# Altium schematic sheet attack_board.SchDoc: <Enter Sheet Title>
size Letter; Organization: NewAE Technology Inc.; Address1: 1083 Queen St., Suite 196; Address2: Halifax; Address3: NS; Address4: Canada B3H 0B2; SheetApproved: NO
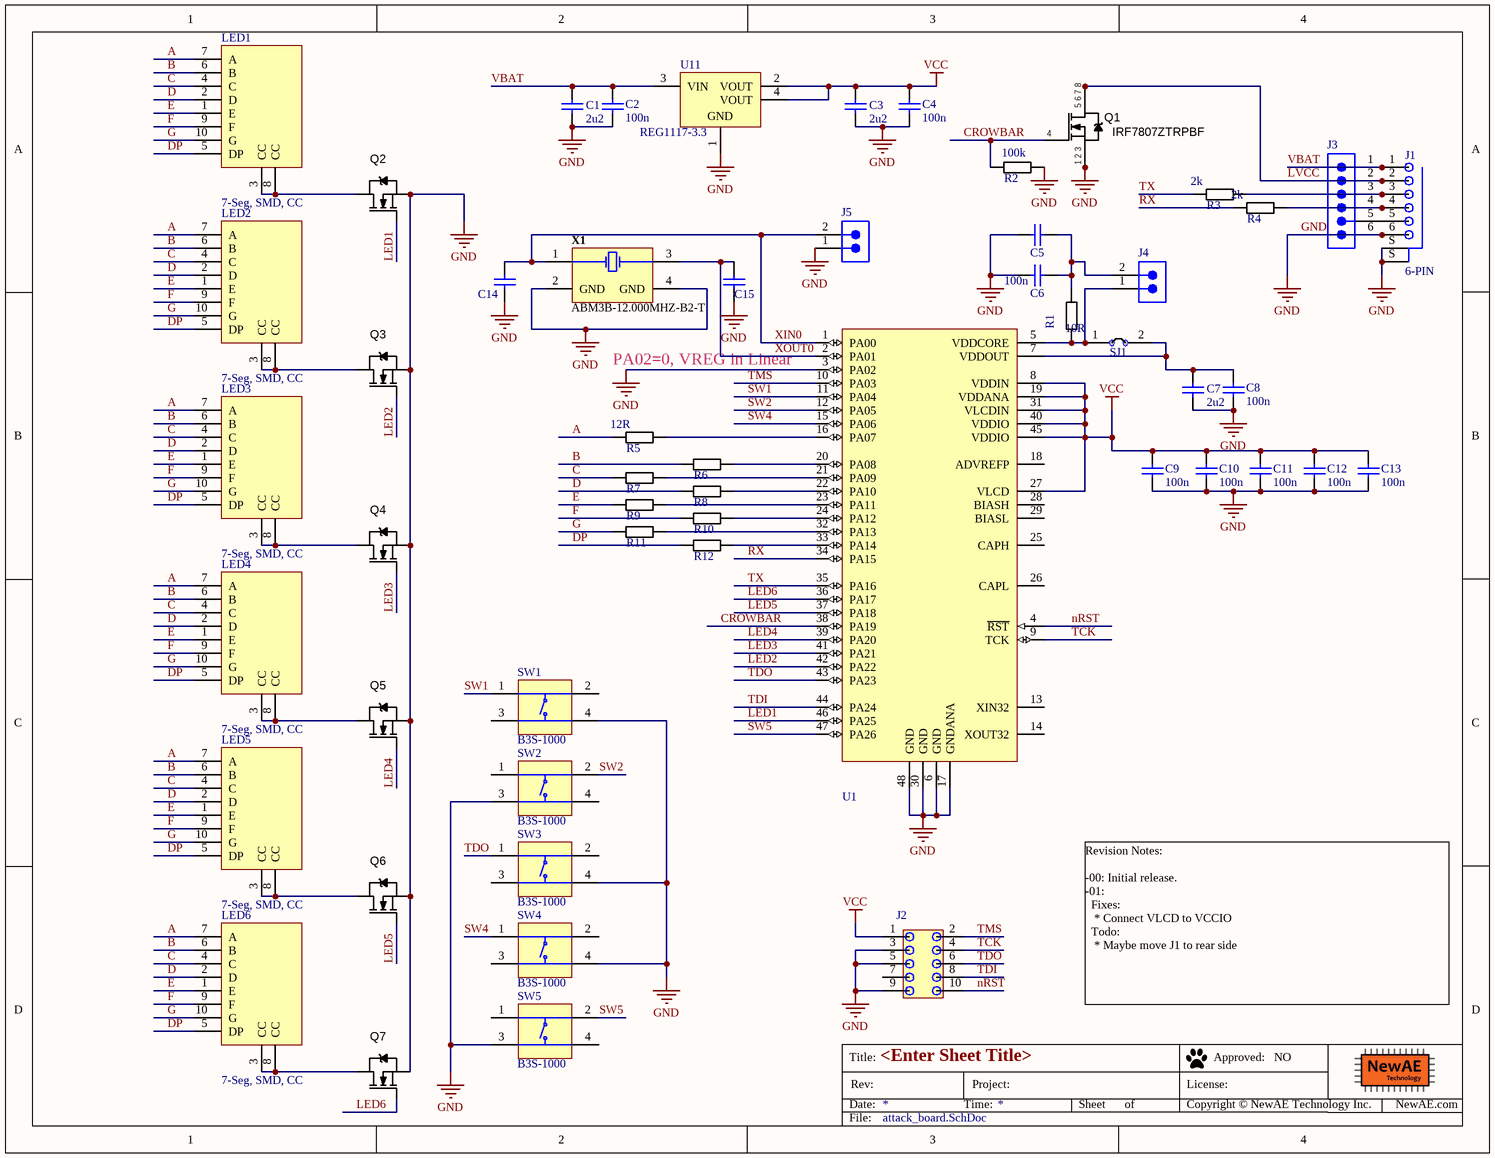
[diagram p0: attack_board.SchDoc]

## Parts
C1  2u2  [CAPC0603_M]
C2  100n  [CAPC0603_M]
C3  2u2  [CAPC0603_M]
C4  100n  [CAPC0603_M]
C5  2u2  [CAPC0603_M]  (value not drawn)
C6  100n  [CAPC0603_M]
C7  2u2  [CAPC0603_M]
C8  100n  [CAPC0603_M]
C9  100n  [CAPC0603_M]
C10  100n  [CAPC0603_M]
C11  100n  [CAPC0603_M]
C12  100n  [CAPC0603_M]
C13  100n  [CAPC0603_M]
C14  18p  [CAPC0402_M]  (value not drawn)
C15  18p  [CAPC0402_M]  (value not drawn)
J1  6-PIN  [10114828-10106LF]
J2  1296-T10  [1296-T10]  (value not drawn)
J3  (no value)  [SMTC-TSW-106-08-X-S-RA]
J4  (no value)  [SMTC-DW-02-16-X-S-200]
J5  (no value)  [SMTC-DW-02-16-X-S-200]
LED1  7-Seg, SMD, CC
LED2  7-Seg, SMD, CC
LED3  7-Seg, SMD, CC
LED4  7-Seg, SMD, CC
LED5  7-Seg, SMD, CC
LED6  7-Seg, SMD, CC
Q1  IRF7807ZTRPBF  [SOIC8_NARROW]
Q2  IRLML2502  [SOT95P245X110-3M]  (value not drawn)
Q3  IRLML2502  [SOT95P245X110-3M]  (value not drawn)
Q4  IRLML2502  [SOT95P245X110-3M]  (value not drawn)
Q5  IRLML2502  [SOT95P245X110-3M]  (value not drawn)
Q6  IRLML2502  [SOT95P245X110-3M]  (value not drawn)
Q7  IRLML2502  [SOT95P245X110-3M]  (value not drawn)
R1  10R  [RESC1608X55N]
R2  100k  [RESC1608X55N]
R3  2k  [RESC1608X55N]
R4  2k  [RESC1608X55N]
R5  12R  [RESC1608X55N]
R6  12R  [RESC1608X55N]  (value not drawn)
R7  12R  [RESC1608X55N]  (value not drawn)
R8  12R  [RESC1608X55N]  (value not drawn)
R9  12R  [RESC1608X55N]  (value not drawn)
R10  12R  [RESC1608X55N]  (value not drawn)
R11  12R  [RESC1608X55N]  (value not drawn)
R12  12R  [RESC1608X55N]  (value not drawn)
SJ1  NC  [SJ_2S_NC]  (value not drawn)  (no BOM)
SW1  B3S-1000  [OMRON-B3S-1000-4_V]
SW2  B3S-1000  [OMRON-B3S-1000-4_V]
SW3  B3S-1000  [OMRON-B3S-1000-4_V]
SW4  B3S-1000  [OMRON-B3S-1000-4_V]
SW5  B3S-1000  [OMRON-B3S-1000-4_V]
U1  ATSAM4LC2AA-AU  [TSQFP50P900X900X120-48N]  (value not drawn)
U11  REG1117-3.3  [TI-DCY4_M]
X1  ABM3B-12.000MHZ-B2-T  [ABRA-ABM3B-4_V]

## Nets
GND: C1.2 C2.1 C3.2 C4.1 C5.1 C6.1 C7.2 C8.1 C9.1 C10.1 C11.1 C12.1 C13.1 C14.1 C15.1 J1.6 J1.S(MNT) J2.3 J2.5 J2.9 J3.6 J5.1 Q1.1(1,2,3) Q1.2(S) Q1.3(S) Q2.2(S) Q3.2(S) Q4.2(S) Q5.2(S) Q6.2(S) Q7.2(S) R2.2 SW1.4 SW2.3 SW3.4 SW4.4 SW5.3 U1.3(PA02) U1.6(GND) U1.17(GNDANA) U1.30(GND) U1.48(GND) U11.1(GND) X1.2(GND) X1.4(GND)
VCC: C3.1 C4.2 C9.2 C10.2 C11.2 C12.2 C13.2 J2.1 U1.8(VDDIN) U1.19(VDDANA) U1.27(VLCD) U1.31(VLCDIN) U1.40(VDDIO) U1.45(VDDIO) U11.2(VOUT) U11.4(VOUT)
A: LED1.7(A) LED2.7(A) LED3.7(A) LED4.7(A) LED5.7(A) LED6.7(A) R5.1
B: LED1.6(B) LED2.6(B) LED3.6(B) LED4.6(B) LED5.6(B) LED6.6(B) R6.1
C: LED1.4(C) LED2.4(C) LED3.4(C) LED4.4(C) LED5.4(C) LED6.4(C) R7.1
CROWBAR: Q1.4(G) R2.1 U1.38(PA19)
D: LED1.2(D) LED2.2(D) LED3.2(D) LED4.2(D) LED5.2(D) LED6.2(D) R8.1
DP: LED1.5(DP) LED2.5(DP) LED3.5(DP) LED4.5(DP) LED5.5(DP) LED6.5(DP) R12.1
E: LED1.1(E) LED2.1(E) LED3.1(E) LED4.1(E) LED5.1(E) LED6.1(E) R9.1
F: LED1.9(F) LED2.9(F) LED3.9(F) LED4.9(F) LED5.9(F) LED6.9(F) R10.1
G: LED1.10(G) LED2.10(G) LED3.10(G) LED4.10(G) LED5.10(G) LED6.10(G) R11.1
LED1: Q2.1(G) U1.46(PA25)
LED2: Q3.1(G) U1.42(PA22)
LED3: Q4.1(G) U1.41(PA21)
LED4: Q5.1(G) U1.39(PA20)
LED5: Q6.1(G) U1.37(PA18)
LED6: Q7.1(G) U1.36(PA17)
LVCC: J1.2 J3.2 Q1.5(5,6,7,8) Q1.6(D) Q1.7(D) Q1.8(D)
nRST: J2.10 U1.4(~{RST})
RX: R4.1 U1.34(PA15)
SW1: SW1.1 U1.11(PA04)
SW2: SW2.2 U1.12(PA05)
SW4: SW4.1 U1.15(PA06)
SW5: SW5.2 U1.47(PA26)
TCK: J2.4 U1.9(TCK)
TDI: J2.8 U1.44(PA24)
TDO: J2.6 SW3.1 U1.43(PA23)
TMS: J2.2 U1.10(PA03)
TX: R3.1 U1.35(PA16)
VBAT: C1.1 C2.2 J1.1 J3.1 U11.3(VIN)
XIN0: C14.2 J5.2 U1.1(PA00) X1.1(X1)
XOUT0: C15.2 U1.2(PA01) X1.3(X2)
NetC5_2: C5.2 C6.2 J4.2 R1.1
NetC7_1: C7.1 C8.2 SJ1.2 U1.7(VDDOUT)
NetJ1_3: J1.3 J3.3 R3.2
NetJ1_4: J1.4 J3.4 R4.2
NetJ1_5: J1.5 J3.5
NetJ4_1: J4.1 R1.2 SJ1.1 U1.5(VDDCORE)
NetLED1_3: LED1.3(CC) LED1.8(CC) Q2.3(D)
NetLED2_3: LED2.3(CC) LED2.8(CC) Q3.3(D)
NetLED3_3: LED3.3(CC) LED3.8(CC) Q4.3(D)
NetLED4_3: LED4.3(CC) LED4.8(CC) Q5.3(D)
NetLED5_3: LED5.3(CC) LED5.8(CC) Q6.3(D)
NetLED6_3: LED6.3(CC) LED6.8(CC) Q7.3(D)
NetR5_2: R5.2 U1.16(PA07)
NetR6_2: R6.2 U1.20(PA08)
NetR7_2: R7.2 U1.21(PA09)
NetR8_2: R8.2 U1.22(PA10)
NetR9_2: R9.2 U1.23(PA11)
NetR10_2: R10.2 U1.24(PA12)
NetR11_2: R11.2 U1.32(PA13)
NetR12_2: R12.2 U1.33(PA14)

Not connected (* = marked no-connect by the designer): J2 7; SW1 2 3; SW2 1 4; SW3 2 3; SW4 2 3; SW5 1 4; U1 13(XIN32) 14(XOUT32) 18(ADVREFP) 25(CAPH) 26(CAPL) 28(BIASH) 29(BIASL)

## Notes on the sheet
- PA02=0, VREG in Linear
- Revision Notes:
  -00: Initial release.
  -01:
  Fixes:
  * Connect VLCD to VCCIO
  Todo:
  * Maybe move J1 to rear side
- Title:
- Date:
- Rev:
- Time:
- Project:
- Sheet
- of
- License:
- Copyright © NewAE Technology Inc.
- Approved:
- NewAE.com
- File:

## Library data of the parts
C1 C3 C5 C7 = CCHIP-2u2-0603: 2u2, 0603; Case-EIA: 0603; Case-Metric: 1608; Part Number: CCHIP-2u2-0603; Component Kind: Standard; Component Type: Standard; Footprint: 0603; Pin Count: 2; Value: 2u2; Mounting Technology: SMT
C2 C4 C6 C8-C13 = CCHIP-100n-0603: 100n, 0603; Case-EIA: 0603; Case-Metric: 1608; Part Number: CCHIP-100n-0603; Component Kind: Standard; Component Type: Standard; Footprint: 0603; Pin Count: 2; Value: 100n; Mounting Technology: SMT
C14 C15 = CCHIP-18p-0402: 18p, 0402; Case-EIA: 0402; Part Number: CCHIP-18p-0402; Component Kind: Standard; Component Type: Standard; Footprint: 0402; Pin Count: 2; Value: 18p; Mounting Technology: SMT
J1 = 10114828-10106LF: 1.25MM, 6POS, VERT SMD; Manufacture 1: FCI; Part Number: 10114828-10106LF; Component Kind: Standard; Component Type: Standard; Manufacture Part Number 1: 10114828-10106LF; Pin Count: 8; Supplier 1: Digi-Key; Supplier Part Number 1: 609-4390-1-ND; Mounting Technology: SMT; Pitch: 1.25mm; RoHS: Yes
J2 = 1296-T10: Header, 10-pin, SMD, 0.05"; Part Number: 1296-T10; Component Kind: Standard; Component Type: Standard; Mounting Technology: SMT
J3 = CMP-1024-00388-1: PartNumber: TSW-106-08-T-S-RA; Manufacturer: Samtec; Pitch: 2.54 mm; ComponentLink2Description: Datasheet; PackageReference: TSW-106-08-X-S-RA; ComponentLink2URL: http://www.samtec.com/documents/webfiles/pdf/TSW_TH.PDF; ComponentLink3Description: Package Specification; ComponentLink3URL: http://www.samtec.com/documents/webfiles/cpdf/TSW-XXX-XX-XXX-X-XX-XXX-MKT.pdf; RoHS: True; PackageVersion: DM, 8/1988; Mounting Technology: Through-hole; ComponentLink1URL: http://www.samtec.com; Temperature Range: -55 to 105 degC; PackageDescription: .025[0.64] SQ. Post Terminal Strip Assembly; DatasheetVersion: F-214; Orientation: Right Angle; ComponentLink1Description: Manufacturer URL
J4 J5 = CMP-1024-00001-1: PartNumber: DW-02-16-G-S-200; Manufacturer: Samtec; Pitch: 2.54 mm; ComponentLink1Description: Manufacturer URL; ComponentLink3Description: Package Specification; DatasheetVersion: F-214; ComponentLink1URL: http://www.samtec.com; RoHS: True; PackageVersion: AX, 8/1984; ComponentLink2URL: http://www.samtec.com/documents/webfiles/pdf/DW.PDF; ComponentLink2Description: Datasheet; Orientation: Vertical; PackageReference: DW-02-16-X-S-200; PackageDescription: Low Cost Board Spacer; ComponentLink3URL: http://www.samtec.com/documents/webfiles/cpdf/XW-XX-XX-XXX-X-XXXX-XXX-XX-XXX-MKT1.PDF; Mounting Technology: Through-hole; Temperature Range: -55 to 125 degC
LED1-LED6 = ACSC03: 7-Seg, CC
Q1 = IRF7807ZTRPBF: MOSFET, N-Channel, 8-SOIC, Logic Level; Manufacturer Part Number 1: AO4420; Manufacturer 1: Alpha & Omega Semiconductor Inc; Manufacture 1: International Rectifier; Material: Silicon; Ratings: 30V; 13.7A; SCDType: source; Package / Case: SOIC-8; ComponentLink1Description: http://www.aosmd.com/res/data_sheets/AO4420.pdf; ComponentLink1URL: http://www.aosmd.com/res/data_sheets/AO4420.pdf; Part Number: IRF7807ZTRPBF; Component Kind: Standard; Component Type: Standard; Footprint: 8-SOIC; Manufacture Part Number 1: IRF7807ZTRPBF; Pin Count: 8; Supplier 1: Digi-Key; Mounting Technology: SMT
Q2-Q7 = IRLML2502: MOSFET, N-Channel, SOT23, Logic Level; Manufacture 1: International Rectifier; Part Number: IRLML2502; Component Kind: Standard; Component Type: Standard; Footprint: SOT23-3; Manufacture Part Number 1: IRLML2502; Pin Count: 3; Supplier 1: Digi-Key
R1 = RCHIP-10R-0603: 10R res, 0603, 1%, 1/10W; Manufacture 1: Yageo; Manufacture Part Number 1: RC0603FR-0710RL; Case-EIA: 0603; Case-Metric: 1608; Rated Power: 0.1W; Rated Voltage: 75VDC; Part Number: RCHIP-10R-0603; Component Kind: Standard; Component Type: Standard; Footprint: 0603; Pin Count: 2; Supplier 1: Digi-Key; Supplier Part Number 1: 311-10.0HRCT-ND; Value: 10R; Tolerance: 1%; Mounting Technology: SMT; Temperature Range: -55C to 155C
R2 = RCHIP-100K-0603: 100k res, 0603, 1%, 1/10W; Manufacture 1: Yageo; Manufacture Part Number 1: RC0603FR-07100KL; Case-EIA: 0603; Case-Metric: 1608; Rated Power: 0.1W; Rated Voltage: 75VDC; Part Number: RCHIP-100K-0603; Component Kind: Standard; Component Type: Standard; Footprint: 0603; Pin Count: 2; Supplier 1: Digi-Key; Supplier Part Number 1: 311-100KHRCT-ND; Value: 100k; Tolerance: 1%; Mounting Technology: SMT; Temperature Range: -55C to 155C
R3 R4 = RCHIP-2K-0603: 2k res, 0603, 1%, 1/10W; Manufacture 1: Yageo; Manufacture Part Number 1: RC0603FR-072KL; Case-EIA: 0603; Case-Metric: 1608; Rated Power: 0.1W; Rated Voltage: 75VDC; Part Number: RCHIP-2K-0603; Component Kind: Standard; Component Type: Standard; Footprint: 0603; Pin Count: 2; Supplier 1: Digi-Key; Supplier Part Number 1: 311-2.00KHRCT-ND; Value: 2k; Tolerance: 1%; Mounting Technology: SMT; Temperature Range: -55C to 155C
R5-R12 = RCHIP-12R-0603: 12R res, 0603, 1%, 1/10W; Manufacture 1: Yageo; Manufacture Part Number 1: RC0603FR-0712RL; Case-EIA: 0603; Case-Metric: 1608; Rated Power: 0.1W; Rated Voltage: 75VDC; Part Number: RCHIP-12R-0603; Component Kind: Standard; Component Type: Standard; Footprint: 0603; Pin Count: 2; Supplier 1: Digi-Key; Supplier Part Number 1: 311-12.0HRCT-ND; Value: 12R; Tolerance: 1%; Mounting Technology: SMT; Temperature Range: -55C to 155C
SJ1 = SJ_2S: Solder Jumper, NC; Part Number: SJ_2S; Component Type: Standard (No BOM); Pin Count: 2; Mounting Technology: COPPER
SW1-SW5 = CMP-1677-00001-4: Sealed Tactile Switch, SPST-NO, 3 to 24 V, -25 to 70 degC, 4-Pin SMD, RoHS, Bulk; Manufacturer: Omron; Voltage Rating: 24 V; Current Rating: 50 mA; Contact Plating: Silver; ComponentLink1Description: Manufacturer URL; Packaging: Bulk; Package Quantity: 1500; Min Operating Temperature: -25 degC; Max Operating Temperature: 70 degC; REACH SVHC: No SVHC; ComponentLink1URL: http://www.omron.com/; RoHSCompliant: true; PackageDescription: 4-Pin Surface Mount Device, Body 6.6 x 6 mm; ComponentLink2URL: http://www.omron.com/ecb/products/pdf/en-b3s.pdf; DatasheetVersion: 10/2014; Length: 6.6 mm; Height: 4.3 mm; ComponentLink2Description: Datasheet; Mount: Surface Mount; Mounting Technology: Surface Mount; PackageReference: B3S-1000
U1 = ATSAM4LC2AA-AU: Atmel, SAM4L, 48-TQFP; Pitch: 0.5mm; Part Number: ATSAM4LC2AA-AU; Component Kind: Standard; Component Type: Standard; Footprint: TQFP48, 0.5mm; Manufacture 1: Atmel; Manufacture Part Number 1: ATSAM4LC2AA-AU; Pin Count: 48; Supplier 1: Digi-Key; Supplier Part Number 1: ATSAM4LC2AA-AU-ND; Mounting Technology: SMT; RoHS: Yes
U11 = CMP-0395-00549-1: Single Output LDO, 800 mA, Fixed 3.3 V Output, 3.8 to 15 V Input, with Internal Current Limiting, 4-pin SOT-223 (DCY), -40 to 125 degC, Green (RoHS & no Sb/Br); Manufacturer: Texas Instruments; Fixed Output Options(V): 5; Iout(Max)(A): 0.8; Iq(Typ)(mA): 4; Vin(Min)(V): 3.8; Vdo(Typ)(mV): 1100; Vout Adj(Min)(V): 3.3; SubFamily: Single Channel LDO; Rating: Catalog; Vin(Max)(V): 15; DatasheetVersion: SBVS001D; ComponentLink2URL: http://www.ti.com/general/docs/lit/getliterature.tsp?genericPartNumber=REG1117-33&fileType=pdf; ComponentLink3URL: http://www.ti.com/litv/pdf/mpds094a; ComponentLink1URL: http://www.ti.com/; PackageVersion: 4202506/B; PackageDescription: 4-Pin Plastic Small Outline, Body 3.5 x 6.5 mm, Pitch 2.3 mm; ComponentLink1Description: Manufacturer URL; Code_JEDEC: TO-261; ComponentLink3Description: Package Specification; Vout Adj(Max)(V): 3.3; Eco-Plan: Green (RoHS & no Sb/Br); PartNumber: REG1117-3.3; ComponentLink2Description: Datasheet; PackageReference: DCY4; Mounting Technology: Surface Mount; Supplier 1: Digi-Key; Supplier Part Number 1: REG1117-3.3-ND
X1 = CMP-1688-00007-1: Ceramic SMD Crystal, 12 MHz, +/- 20 ppm, 70 Ohm, -20 to 70 degC, 4-Pin SMD, RoHS, Tape and Reel; Case\Package: TO-263-4; Outputs: 1; Max Input Voltage: 25 V; Dropout Voltage: 2 V; Max Ouput Current: 1.5 A; Nominal Output Voltage: 5 V; Min Input Voltage: 7 V; Mount: Surface Mount; ComponentLink2Description: Datasheet; DatasheetVersion: Aug-15; PackageReference: ABM3B; Radiation Hardening: No; Weight: 0.050897 oz; ComponentLink1URL: http://www.abracon.com/; RoHSCompliant: true; Max Operating Temperature: 125 degC; PackageDescription: 4-Pin Surface Mount Device, Body 5 x 3.2 mm; ComponentLink1Description: Manufacturer URL; Package Quantity: 500; Output Voltage: 5 V; ComponentLink2URL: http://www.abracon.com/Resonators/abm3b.pdf; Min Operating Temperature: 0 degC; Output Current: 1.5 A; Packaging: Tape and Reel; Pins: 3; REACH SVHC: No SVHC